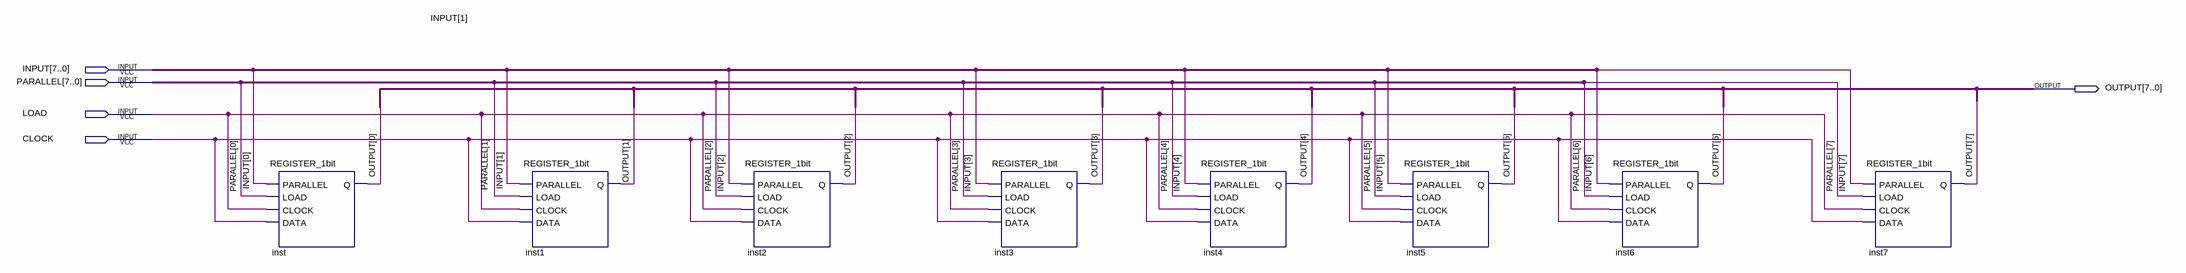
[diagram p0: schematic sheet]
// Quartus schematic REGISTER_8bit.bdf as structural Verilog: 8 symbols, 5 pins
module REGISTER_8bit (
  input  [7:0] INPUT,
  input  [7:0] PARALLEL,
  input  LOAD,
  input  CLOCK,
  output [7:0] OUTPUT
);

  REGISTER_1bit inst (.PARALLEL(INPUT[0]), .LOAD(PARALLEL[0]), .CLOCK(LOAD), .DATA(CLOCK), .Q(OUTPUT[0]));
  REGISTER_1bit inst1 (.PARALLEL(INPUT[1]), .LOAD(PARALLEL[1]), .CLOCK(LOAD), .DATA(CLOCK), .Q(OUTPUT[1]));
  REGISTER_1bit inst2 (.PARALLEL(INPUT[2]), .LOAD(PARALLEL[2]), .CLOCK(LOAD), .DATA(CLOCK), .Q(OUTPUT[2]));
  REGISTER_1bit inst3 (.PARALLEL(INPUT[3]), .LOAD(PARALLEL[3]), .CLOCK(LOAD), .DATA(CLOCK), .Q(OUTPUT[3]));
  REGISTER_1bit inst4 (.PARALLEL(INPUT[4]), .LOAD(PARALLEL[4]), .CLOCK(LOAD), .DATA(CLOCK), .Q(OUTPUT[4]));
  REGISTER_1bit inst5 (.PARALLEL(INPUT[5]), .LOAD(PARALLEL[5]), .CLOCK(LOAD), .DATA(CLOCK), .Q(OUTPUT[5]));
  REGISTER_1bit inst6 (.PARALLEL(INPUT[6]), .LOAD(PARALLEL[6]), .CLOCK(LOAD), .DATA(CLOCK), .Q(OUTPUT[6]));
  REGISTER_1bit inst7 (.PARALLEL(INPUT[7]), .LOAD(PARALLEL[7]), .CLOCK(LOAD), .DATA(CLOCK), .Q(OUTPUT[7]));
endmodule
